# EAGLE schematic charging (EAGLE 6.5.0)
AUTHOR: N.Jackson; REV: A; TITLE: BMO CHARGER
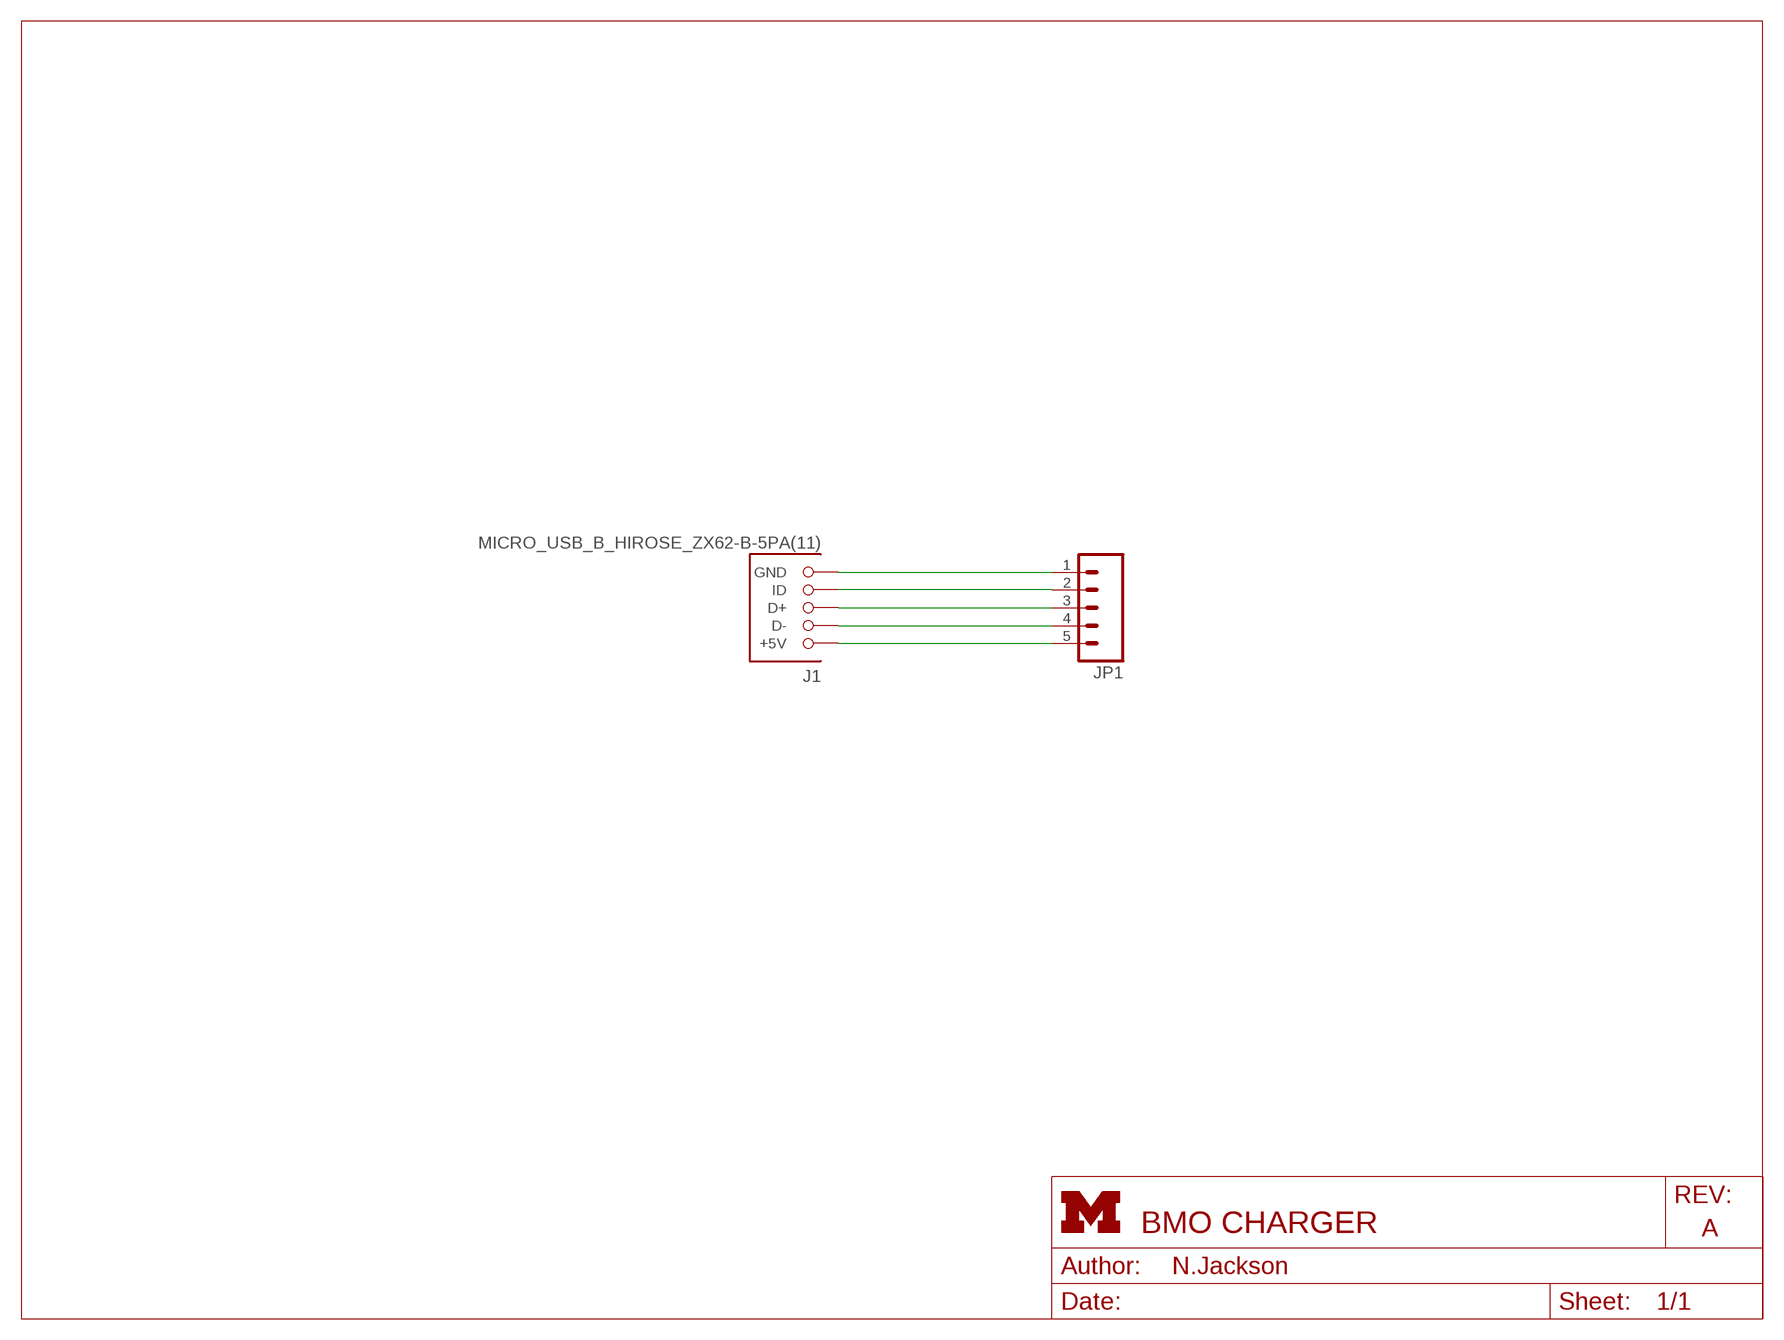
[diagram p0: schematic, sheet 1]
FRAME1 (LETTER_L): HEIGHT: 8.5in; WIDTH: 11in

## Parts
J1  MICRO_USB_B_HIROSE_ZX62-B-5PA(11)  [USB_MICRO_B-HIROSE-ZX62-B-5PA(11)]
JP1  M05PTH  [1X05]

## Nets
5V: J1.1(+5V) JP1.5
D+: J1.3(D+) JP1.3
D-: J1.2(D-) JP1.4
GND: J1.5(GND) JP1.1
ID: J1.4(ID) JP1.2

## Library data of the parts
J1 = connector:MICRO_USB_B_HIROSE_ZX62-B-5PA(11): Connector Receptacle USB - micro B 2.0 5 Position Surface Mount, Right Angle, Horizontal Bottom Mount; DIGIKEY: H11634CT-ND; MOUSER: 798-ZX62-B-5PA11; NEWARK: 86P8793
JP1 = SparkFun-Connectors:M05: Header 5 Standard 5-pin 0.1" header. Use with straight break away headers (SKU : PRT-00116), right angle break away headers (PRT-00553), swiss pins (PRT-00743), machine pins (PRT-00117), and female headers (PRT-00115). Molex polarized connector foot print use with SKU : PRT-08230 with associated crimp pins and housings.